# EAGLE design ComboBreaker (EAGLE 8.3.2)
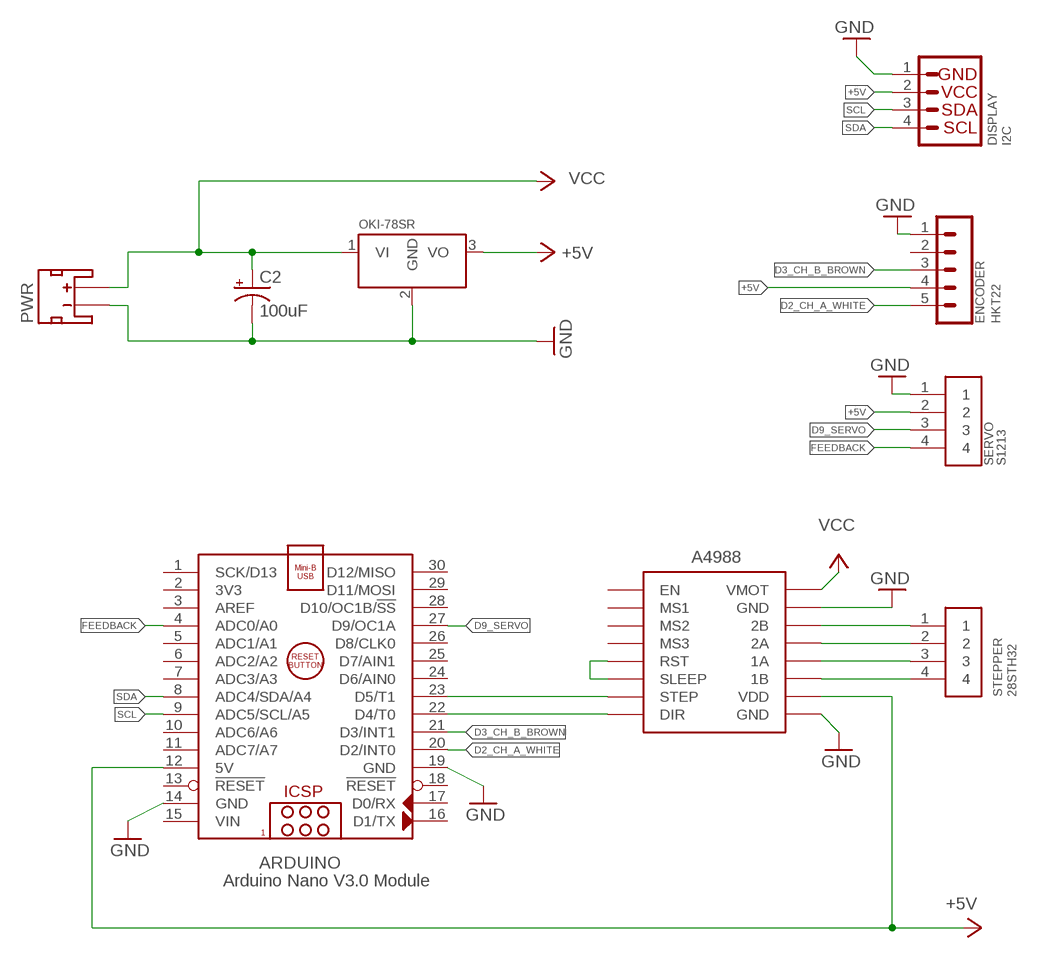
[diagram p0: schematic, sheet 1]

## Parts
A4988  StepStick  A4988BREAKOUT  [A4988BREAKOUT]
ARDUINO  Arduino Nano V3.0 Module  ARDUINO_NANO  [ARDUINO_NANO]
C2  100uF  CPOL-USE3.5-8  [E3,5-8]
DISPLAY  I2C  I2C_STANDARD  [1X04]
ENCODER  HKT22  CON-LSTB_MA05-1  [CON-LSTB_MA05-1]
OKI-78SR  5/1.5-W36H-C  DCDC_OKI-78SR  [OKI-78SRH]
PWR  7-35v  JST_2MM_MALE  [JST-2-SMD]
SERVO  S1213  ADAFRUIT_1X4-BIG  [ADAFRUIT_1X04-BIG]
STEPPER  28STH32  ADAFRUIT_1X4-BIG  [ADAFRUIT_1X04-BIG]

## Nets
1A_GRN: A4988.1A STEPPER.3
1B_BLK: A4988.1B STEPPER.4
2A_RED: A4988.2A STEPPER.2
2B_BLU: A4988.2B STEPPER.1
+5V: A4988.VDD ARDUINO.12(5V) DISPLAY.2 ENCODER.4 OKI-78SR.3(VO) SERVO.2
D2_CH_A_WHITE: ARDUINO.20(D2/INT0) ENCODER.5
D3_CH_B_BROWN: ARDUINO.21(D3/INT1) ENCODER.3
D9_SERVO: ARDUINO.27(D9/OC1A) SERVO.3
FEEDBACK: ARDUINO.4(ADC0/A0) SERVO.4
GND: A4988.GND A4988.GND@0(GND) ARDUINO.14(GND) ARDUINO.19(GND) C2.- DISPLAY.1 ENCODER.1 OKI-78SR.2(GND) PWR.GND(-) SERVO.1
N$1: A4988.RST A4988.SLP(SLEEP)
N$2: A4988.DIR ARDUINO.22(D4/T0)
N$3: A4988.STEP ARDUINO.23(D5/T1)
SCL: ARDUINO.9(ADC5/SCL/A5) DISPLAY.3
SDA: ARDUINO.8(ADC4/SDA/A4) DISPLAY.4
VCC: A4988.VMOT C2.+ OKI-78SR.1(VI) PWR.2(+)
Unconnected: A4988.EN A4988.MS1 A4988.MS2 A4988.MS3 ARDUINO.1(SCK/D13) ARDUINO.2(3V3) ARDUINO.3(AREF) ARDUINO.5(ADC1/A1) ARDUINO.6(ADC2/A2) ARDUINO.7(ADC3/A3) ARDUINO.10(ADC6/A6) ARDUINO.11(ADC7/A7) ARDUINO.13(!RESET) ARDUINO.16(D1/TX) ARDUINO.17(D0/RX) ARDUINO.18(!RESET) ARDUINO.24(D6/AIN0) ARDUINO.25(D7/AIN1) ARDUINO.26(D8/CLK0) ARDUINO.28(D10/OC1B/!SS) ARDUINO.29(D11/MOSI) ARDUINO.30(D12/MISO) ENCODER.2 PWR.NC1(PAD1) PWR.NC2(PAD2)

## Power pins joined to a net without a drawn wire
VIN: ARDUINO.15(VIN)

## Library data of the parts
A4988 = RepRapjr:A4988BREAKOUT
ARDUINO = ArduinoNanoV30:ARDUINO_NANO: Arduino Nano V3.0 Module Overview: The Arduino Nano is a small, complete, and breadboard-friendly board based on the ATmega328 (Arduino Nano 3.x) or ATmega168 (Arduino Nano 2.x). It has more or less the same functionality of the Arduino Duemilanove, but in a different package. It lacks only a DC power jack, and works with a Mini-B USB cable instead of a standard one. The Nano was designed and is being produced by Gravitech <http://www.gravitech.us/arna30wiatp.html>. General specifications: Item Value Microcontroller Atmel ATmega168 or ATmega328 Operating Voltage (logic level) 5 V Input Voltage (recommended) 7-12 V Input Voltage (limits) 6-20 V Digital I/O Pins 14 (of which 6 provide PWM output) Analog Input Pins 8 DC Current per I/O Pin 40 mA Flash Memory 16 KB (ATmega168) or 32 KB (ATmega328) of which 2 KB used by bootloader SRAM 1 KB (ATmega168) or 2 KB (ATmega328) EEPROM 512 bytes (ATmega168) or 1 KB (ATmega328) Clock Speed 16 MHz Dimensions (Inches) 0.73" x 1.70" Dimensions (mm) 18mm x 45mm Overall height About 9 mm (not including pins) Weigth 5 g Power: The Arduino Nano can be powered via the Mini-B USB connection, 6-20V unregulated external power supply (pin 30), or 5V regulated external power supply (pin 27). The power source is automatically selected to the highest voltage source. Memory: The ATmega168 has 16 KB of flash memory for storing code (of which 2 KB is used for the bootloader); the ATmega328 has 32 KB, (also with 2 KB used for the bootloader). The ATmega168 has 1 KB of SRAM and 512 bytes of EEPROM (which can be read and written with the EEPROM library); the ATmega328 has 2 KB of SRAM and 1 KB of EEPROM. Input and Output: Each of the 14 digital pins on the Nano can be used as an input or output, using pinMode(), digitalWrite(), and digitalRead() functions. They operate at 5 volts. Each pin can provide or receive a maximum of 40 mA and has an internal pull-up resistor (disconnected by default) of 20-50 kOhms. In addition, some pins have specialized functions. Visit Arduino - ArduinoBoardNano <https://www.arduino.cc/en/Main/ArduinoBoardNano>
C2 = resistor:CPOL-US: POLARIZED CAPACITOR, American symbol
DISPLAY = SparkFun-Connectors:I2C_STANDARD: SparkFun I2C Standard Pinout Header SparkFun has standardized on a pinout for all I2C based sensor breakouts. This pinout allows I2C boards to be plugged directly into the headers on Arduino Uno compatible boards, and to be daisy chained easily. Example SparkFun Products: SparkFun Atmospheric Sensor Breakout - BME280 <https://www.sparkfun.com/products/13676> SparkFun Altitude/Pressure Sensor Breakout - MPL3115A2 <https://www.sparkfun.com/products/11084> SparkFun TOF Range Finder Sensor - VL6180 <https://www.sparkfun.com/products/12785>
ENCODER = ComboBreaker:CON-LSTB_MA05-1: PIN HEADER; OC_FARNELL: unknown; OC_NEWARK: unknown
OKI-78SR = carrilib:DCDC_OKI-78SR: 4.95W DC/DC Converter Manufacturer: Murata Part Number: OKI-78SR-5/1.5-W36H-C OKI-78SR-3.3/1.5-W36H-C
PWR = SparkFun-Connectors:JST_2MM_MALE: JST 2MM MALE RA CONNECTOR Two pin, compact surface mount connector. Commonly used as a battery input connection point. We really like the solid locking feeling and high current rating on these small connectors. We use these all the time as battery connectors. Mates to single-cell LiPo batteries. Here is the connector we sell at SparkFun: JST Right Angle Connector - White <https://www.sparkfun.com/products/8612> (PRT-08612) Datasheet <http://www.sparkfun.com/datasheets/Prototyping/Connectors/JST-Horizontal.pdf> It was used on these SparkFun products: SparkFun MOSFET Power Controller <https://www.sparkfun.com/products/11214> (PRT-11214) SparkFun Battery Babysitter - LiPo Battery Manager <https://www.sparkfun.com/products/13777> (PRT-13777) And many, many others that required a lipo battery connection.; PROD_ID: CONN-11443; SF_ID: PRT-08612
SERVO STEPPER = ComboBreaker:ADAFRUIT_1X4: 4-pin connector

## Board
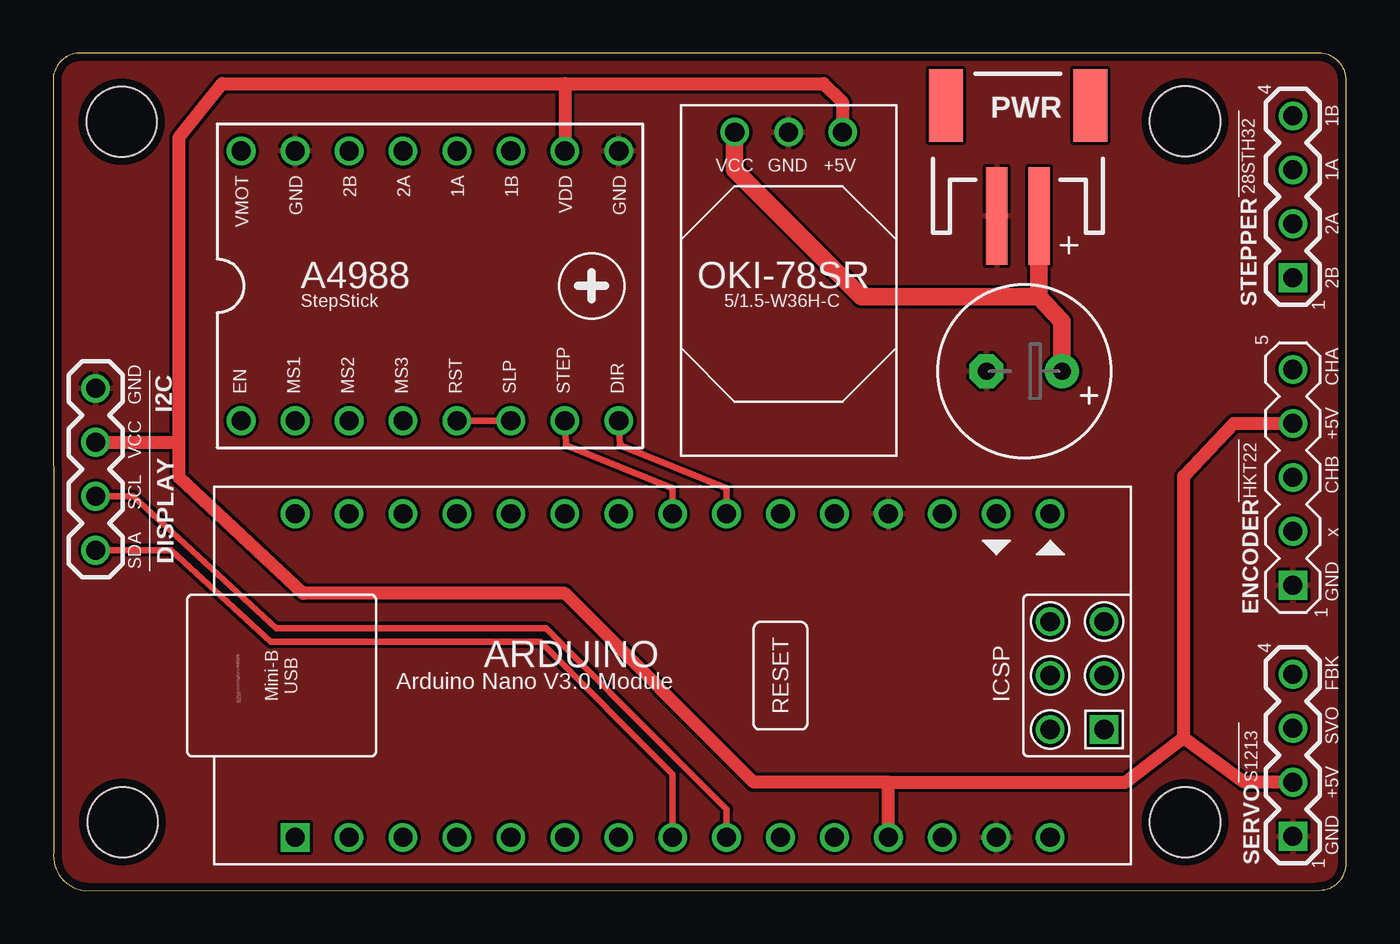
[diagram p1: board, top side]
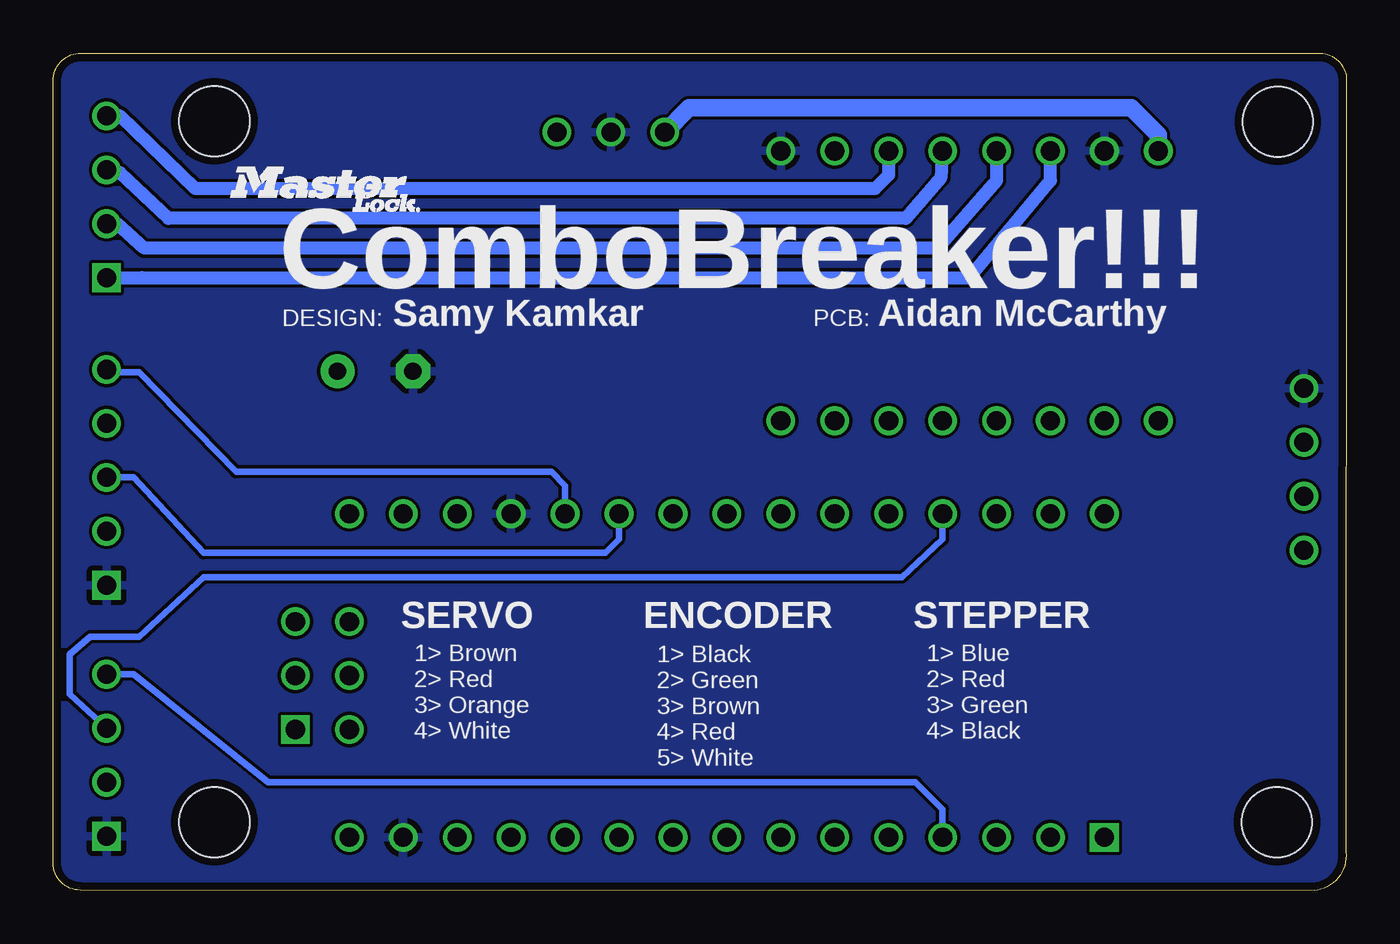
[diagram p2: board, bottom side, seen from below]

Size 60.91 x 39.43 mm. Coordinates in mm from the lower left corner, seen from the top.
Outline: 0,38.12 0.02,1.82 arc90 1.52,0 59.64,0.03 arc90 60.91,1.3 60.91,38.13 arc90 59.6,39.43 1.24,39.43 arc90 0,38.12
Copper layers (1*16): Top 0.0356mm / dielectric 1.5011mm / Bottom 0.0356mm
Design rules "oshpark-2layer": minimum track width 6mil, minimum drill 13mil, track to track 6mil, track to pad 6mil, pad to pad 6mil, via to via 6mil, smd to smd 6mil, copper to edge 15mil, drill to drill 6mil, minimum pad ring 7mil, minimum via ring 7mil, stop-mask expansion 2.5mil, vias tented up to drill 0mil, thermal gap 10mil

### Footprints (pad centres in the part's own frame; a part is rotated, then mirrored left to right if it is on the bottom)
A4988BREAKOUT = drill 0.9: 1A 6.35,0; 1B 6.35,-2.54; 2A 6.35,2.54; 2B 6.35,5.08; DIR -6.35,-7.62; EN -6.35,10.16; GND 6.35,-7.62; GND@0 6.35,7.62; MS1 -6.35,7.62; MS2 -6.35,5.08; MS3 -6.35,2.54; RST -6.35,0; SLP -6.35,-2.54; STEP -6.35,-5.08; VDD 6.35,-5.08; VMOT 6.35,10.16
ARDUINO_NANO = drill 0.9 square: 1 -13.97,-7.62; 36 24.13,-2.54 | drill 0.9: 2 -11.43,-7.62; 3 -8.89,-7.62; 4 -6.35,-7.62; 5 -3.81,-7.62; 6 -1.27,-7.62; 7 1.27,-7.62; 8 3.81,-7.62; 9 6.35,-7.62; 10 8.89,-7.62; 11 11.43,-7.62; 12 13.97,-7.62; 13 16.51,-7.62; 14 19.05,-7.62; 15 21.59,-7.62; 16 21.59,7.62; 17 19.05,7.62; 18 16.51,7.62; 19 13.97,7.62; 20 11.43,7.62; 21 8.89,7.62; 22 6.35,7.62; 23 3.81,7.62; 24 1.27,7.62; 25 -1.27,7.62; 26 -3.81,7.62; 27 -6.35,7.62; 28 -8.89,7.62; 29 -11.43,7.62; 30 -13.97,7.62; 31 21.59,-2.54; 32 21.59,0; 33 21.59,2.54; 34 24.13,2.54; 35 24.13,0
E3,5-8 = drill 0.813 pad 1.6: + -1.778,0 | drill 0.813 pad 1.6 octagon: - 1.778,0
1X04 = drill 0.9: 1 0,0; 2 2.54,0; 3 5.08,0; 4 7.62,0
CON-LSTB_MA05-1 = drill 0.9 square: 1 -5.08,0 | drill 0.9: 2 -2.54,0; 3 0,0; 4 2.54,0; 5 5.08,0
OKI-78SRH = drill 0.9: 1 2.54,-10.16; 2 0,-10.16; 3 -2.54,-10.16
JST-2-SMD = smd 1 x 4.6: 2 1,-3.7; GND -1,-3.7 | smd 1.6 x 3.4: NC1 -3.4,1.5; NC2 3.4,1.5
ADAFRUIT_1X04-BIG = drill 0.9 square: 1 0,0 | drill 0.9: 2 2.54,0; 3 5.08,0; 4 7.62,0
STAND-OFF = hole 3.302: 0,0

### Placement (x,y rotation side)
A4988  19.02,28.48 90 top
ARDUINO  25.37,10.13 0 top
C2  45.74,24.45 180 top
DISPLAY  2,23.65 270 top
ENCODER  58.39,19.46 90 top
OKI-78SR  34.64,25.55 180 top
PWR  45.44,35.47 0 top
SERVO  58.39,2.57 90 top
STEPPER  58.39,28.86 90 top
U$1  [STAND-OFF]  3.27,3.23 0 top
U$2  [STAND-OFF]  3.23,36.2 0 top
U$3  [STAND-OFF]  53.31,36.22 0 top
U$4  [STAND-OFF]  53.31,3.22 0 top
U$5  [AM]  52.8,27.84 90 top
U$6  [MASTERLOCK2]  48.1,33.05 0 bottom

### Tracks (layer width: path | path; a pad name or v marks a point on that pad's centre or on a via)
1A_GRN
  Bottom 0.305: 58.26,33.81 STEPPER.3
  Bottom 0.61: A4988.1A 19.1,33.56 20.75,31.65 55.47,31.65 57.75,33.81 58.26,33.81
1B_BLK
  Bottom 0.61: A4988.1B 21.56,33.68 22.19,33.05 54.2,33.05 57.75,36.48 STEPPER.4
2A_RED
  Bottom 0.61: A4988.2A 16.48,33.43 19.27,30.25 56.61,30.25 57.88,31.4 STEPPER.2
2B_BLU
  Bottom 0.61: STEPPER.1 57.25,28.86 56.74,28.86 17.75,28.86 13.94,33.43 A4988.2B
+5V
  Top 0.61: 58.52,22 ENCODER.4 55.6,22 53.25,19.52 53.25,7.2 | 39.34,5.11 ARDUINO.12 | DISPLAY.2 5.94,21.11 | 39.34,5.11 32.99,5.11 24.1,14 11.78,14 5.94,19.46 5.94,21.11 | 53.25,7.2 50.52,5.11 39.34,5.11 | 53.25,7.2 56.1,5.11 SERVO.2 | 24.1,38 7.97,38 5.94,35.46 5.94,21.11 | 24.1,38 A4988.VDD | OKI-78SR.3 37.18,37.11 36.29,38 24.1,38
D2_CH_A_WHITE
  Bottom 0.305: ARDUINO.20 36.8,19.08 37.43,19.71 52.29,19.71 56.87,24.41 58.26,24.41 ENCODER.5
D3_CH_B_BROWN
  Bottom 0.305: ARDUINO.21 34.26,16.54 34.89,15.9 53.82,15.9 57.12,19.46 ENCODER.3
D9_SERVO
  Bottom 0.305: ARDUINO.27 19.02,16.54 20.92,14.76 53.82,14.76 56.87,11.97 59.15,11.97 60.12,11.12 60.12,9.25 SERVO.3
FEEDBACK
  Bottom 0.305: ARDUINO.4 19.02,3.84 20.29,5.11 50.77,5.11 57.12,10.19 SERVO.4
GND
  pour Bottom: 60.93,1.37 60.9,38.13 arc90 59.58,39.44 1.6,39.44 arc90 0.02,37.85 0.04,1.36 arc90 1.38,0.02 59.59,0.03 arc90
  pour Top: -0.03,1.3 -0.03,38.13 arc-90 1.24,39.4 59.66,39.4 arc-90 60.93,38.13 60.93,1.3 arc-90 59.66,0.03 1.24,0.03 arc-90
N$1
  Top 0.305: A4988.RST A4988.SLP
N$2
  Top 0.305: A4988.DIR 26.71,20.98 31.72,18.95 ARDUINO.22
N$3
  Top 0.305: A4988.STEP 24.17,20.98 29.18,18.95 ARDUINO.23
N$4
  pour Top: -0.03,38.13 -0.03,1.3 arc90 1.24,0.03 59.66,0.03 arc90 60.93,1.3 60.93,38.13 arc90 59.66,39.4 1.24,39.4 arc90
SCL
  Top 0.305: ARDUINO.9 31.72,3.84 29.18,6.38 23.21,12.35 10.51,12.35 3.78,18.57 DISPLAY.3
SDA
  Top 0.305: DISPLAY.4 5.56,16.03 10.26,11.71 22.96,11.71 29.18,5.49 ARDUINO.8
VCC
  Top 0.406: PWR.2
  Top 0.813: 46.44,27.96 45.18,27.97 38.07,27.97 32.1,33.94 OKI-78SR.1 | 46.44,27.96 46.44,29.25 46.44,30.52 PWR.2 | 46.44,27.96 47.51,26.8 C2.+
  Bottom 0.813: A4988.VMOT 8.86,35.59 10.13,36.86 30.96,36.86 OKI-78SR.1

### Text on the board
tPlace: 1B | VCC | GND | +5V | 1A | 2A | 2B | CHA | GND | +5V | VCC | CHB | SCL | x | SDA | GND | FBK | SVO | +5V | GND
bPlace: ComboBreaker!!! | Aidan McCarthy | PCB: | Samy Kamkar | DESIGN: | STEPPER | ENCODER | SERVO | 1> Blue / 2> Red / 3> Green / 4> Black | 1> Brown / 2> Red / 3> Orange / 4> White | 1> Black / 2> Green / 3> Brown / 4> Red / 5> White